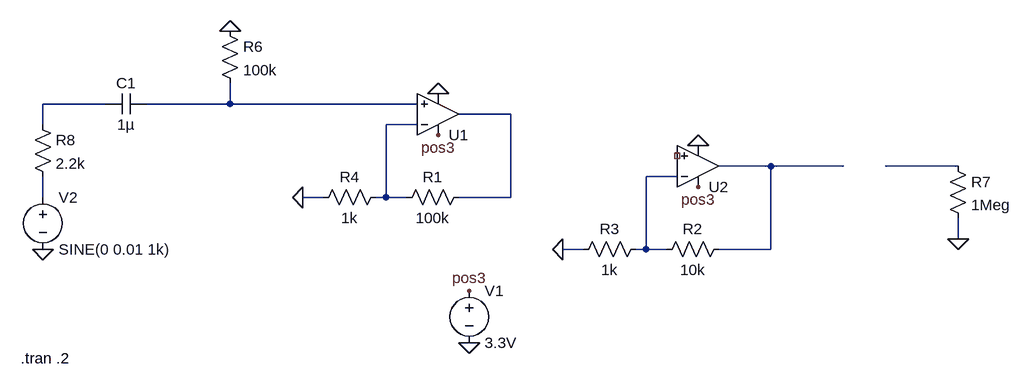
[diagram p0: schematic clap_detector_vinc.asc]
clap_detector_vinc.asc, the LTspice schematic file:
Version 4
SHEET 1 1000 680
WIRE -400 64 -496 64
WIRE -208 64 -208 32
WIRE -208 64 -336 64
WIRE 80 64 -208 64
WIRE 224 80 144 80
WIRE -496 96 -496 64
WIRE 80 96 32 96
WIRE 624 160 544 160
WIRE 736 160 624 160
WIRE 912 160 800 160
WIRE 480 176 432 176
WIRE -496 208 -496 176
WIRE -64 208 -96 208
WIRE 32 208 32 96
WIRE 32 208 16 208
WIRE 64 208 32 208
WIRE 224 208 224 80
WIRE 224 208 144 208
WIRE 912 272 912 240
WIRE 336 288 304 288
WIRE 432 288 432 176
WIRE 432 288 416 288
WIRE 464 288 432 288
WIRE 624 288 624 160
WIRE 624 288 544 288
FLAG 160 432 0
FLAG 160 352 pos3
FLAG 512 128 0
FLAG 512 192 pos3
FLAG 304 288 0
FLAG 112 48 0
FLAG 112 112 pos3
FLAG -96 208 0
FLAG -496 288 0
FLAG 912 272 0
FLAG -208 -48 0
SYMBOL voltage 160 336 R0
WINDOW 123 0 0 Left 0
WINDOW 39 0 0 Left 0
SYMATTR InstName V1
SYMATTR Value 3.3V
SYMBOL OpAmps\\UniversalOpamp2 512 160 M180
SYMATTR InstName U2
SYMBOL res 560 272 R90
WINDOW 0 0 56 VBottom 2
WINDOW 3 32 56 VTop 2
SYMATTR InstName R2
SYMATTR Value 10k
SYMBOL res 432 272 R90
WINDOW 0 0 56 VBottom 2
WINDOW 3 32 56 VTop 2
SYMATTR InstName R3
SYMATTR Value 1k
SYMBOL OpAmps\\UniversalOpamp2 112 80 M180
SYMATTR InstName U1
SYMBOL res 160 192 R90
WINDOW 0 0 56 VBottom 2
WINDOW 3 32 56 VTop 2
SYMATTR InstName R1
SYMATTR Value 100k
SYMBOL res 32 192 R90
WINDOW 0 0 56 VBottom 2
WINDOW 3 32 56 VTop 2
SYMATTR InstName R4
SYMATTR Value 1k
SYMBOL cap -336 48 R90
WINDOW 0 0 32 VBottom 2
WINDOW 3 32 32 VTop 2
SYMATTR InstName C1
SYMATTR Value 1µ
SYMBOL voltage -496 192 R0
WINDOW 123 0 0 Left 0
WINDOW 39 0 0 Left 0
SYMATTR InstName V2
SYMATTR Value SINE(0 0.01 1k)
SYMBOL res 896 144 R0
SYMATTR InstName R7
SYMATTR Value 1Meg
SYMBOL res -224 -64 R0
SYMATTR InstName R6
SYMATTR Value 100k
SYMBOL res -512 80 R0
SYMATTR InstName R8
SYMATTR Value 2.2k
TEXT -530 456 Left 2 !.tran .2

The netlist it stands for:
* clap_detector_vinc.asc
V1 pos3 0 3.3V
XU2 NC_01 N007 pos3 0 N005 level.2 Avol=1Meg GBW=10Meg Slew=10Meg ilimit=25m rail=0 Vos=0 phimargin=45 en=0 enk=0 in=0 ink=0 Rin=500Meg  ; pins IN+ IN- V+ V- OUT
R2 N005 N007 10k
R3 N007 0 1k
XU1 N002 N004 pos3 0 N003 level.2 Avol=1Meg GBW=10Meg Slew=10Meg ilimit=25m rail=0 Vos=0 phimargin=45 en=0 enk=0 in=0 ink=0 Rin=500Meg  ; pins IN+ IN- V+ V- OUT
R1 N003 N004 100k
R4 N004 0 1k
C1 N002 N001 1µ
V2 N008 0 SINE(0 0.01 1k)
R7 N006 0 1Meg
R6 0 N002 100k
R8 N001 N008 2.2k
.tran .2
.lib UniversalOpamps2.sub
.backanno
.end